# Altium schematic sheet DROP.SchDoc
size A4
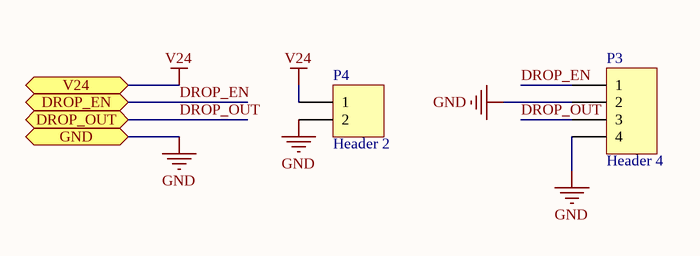
[diagram p0: DROP.SchDoc]

## Parts
P3  Header 4  [4P_XH2.54]
P4  Header 2  [2P_XH2.54]

## Ports
DROP_EN, DROP_OUT, GND, V24

## Nets
GND: P3.2 P3.4 P4.2 ; port GND
V24: P4.1 ; port V24
DROP_EN: P3.1 ; port DROP_EN
DROP_OUT: P3.3 ; port DROP_OUT

## Library data of the parts
P3 = Header 4: Header, 4-Pin; LatestRevisionDate: 17-Jul-2002; LatestRevisionNote: Re-released for DXP Platform.; Publisher: Altium Limited
P4 = Header 2: Header, 2-Pin; LatestRevisionDate: 17-Jul-2002; LatestRevisionNote: Re-released for DXP Platform.; Publisher: Altium Limited